# EAGLE design H3_MIDIController_Rev_2_PZBoard (EAGLE 7.6.0)
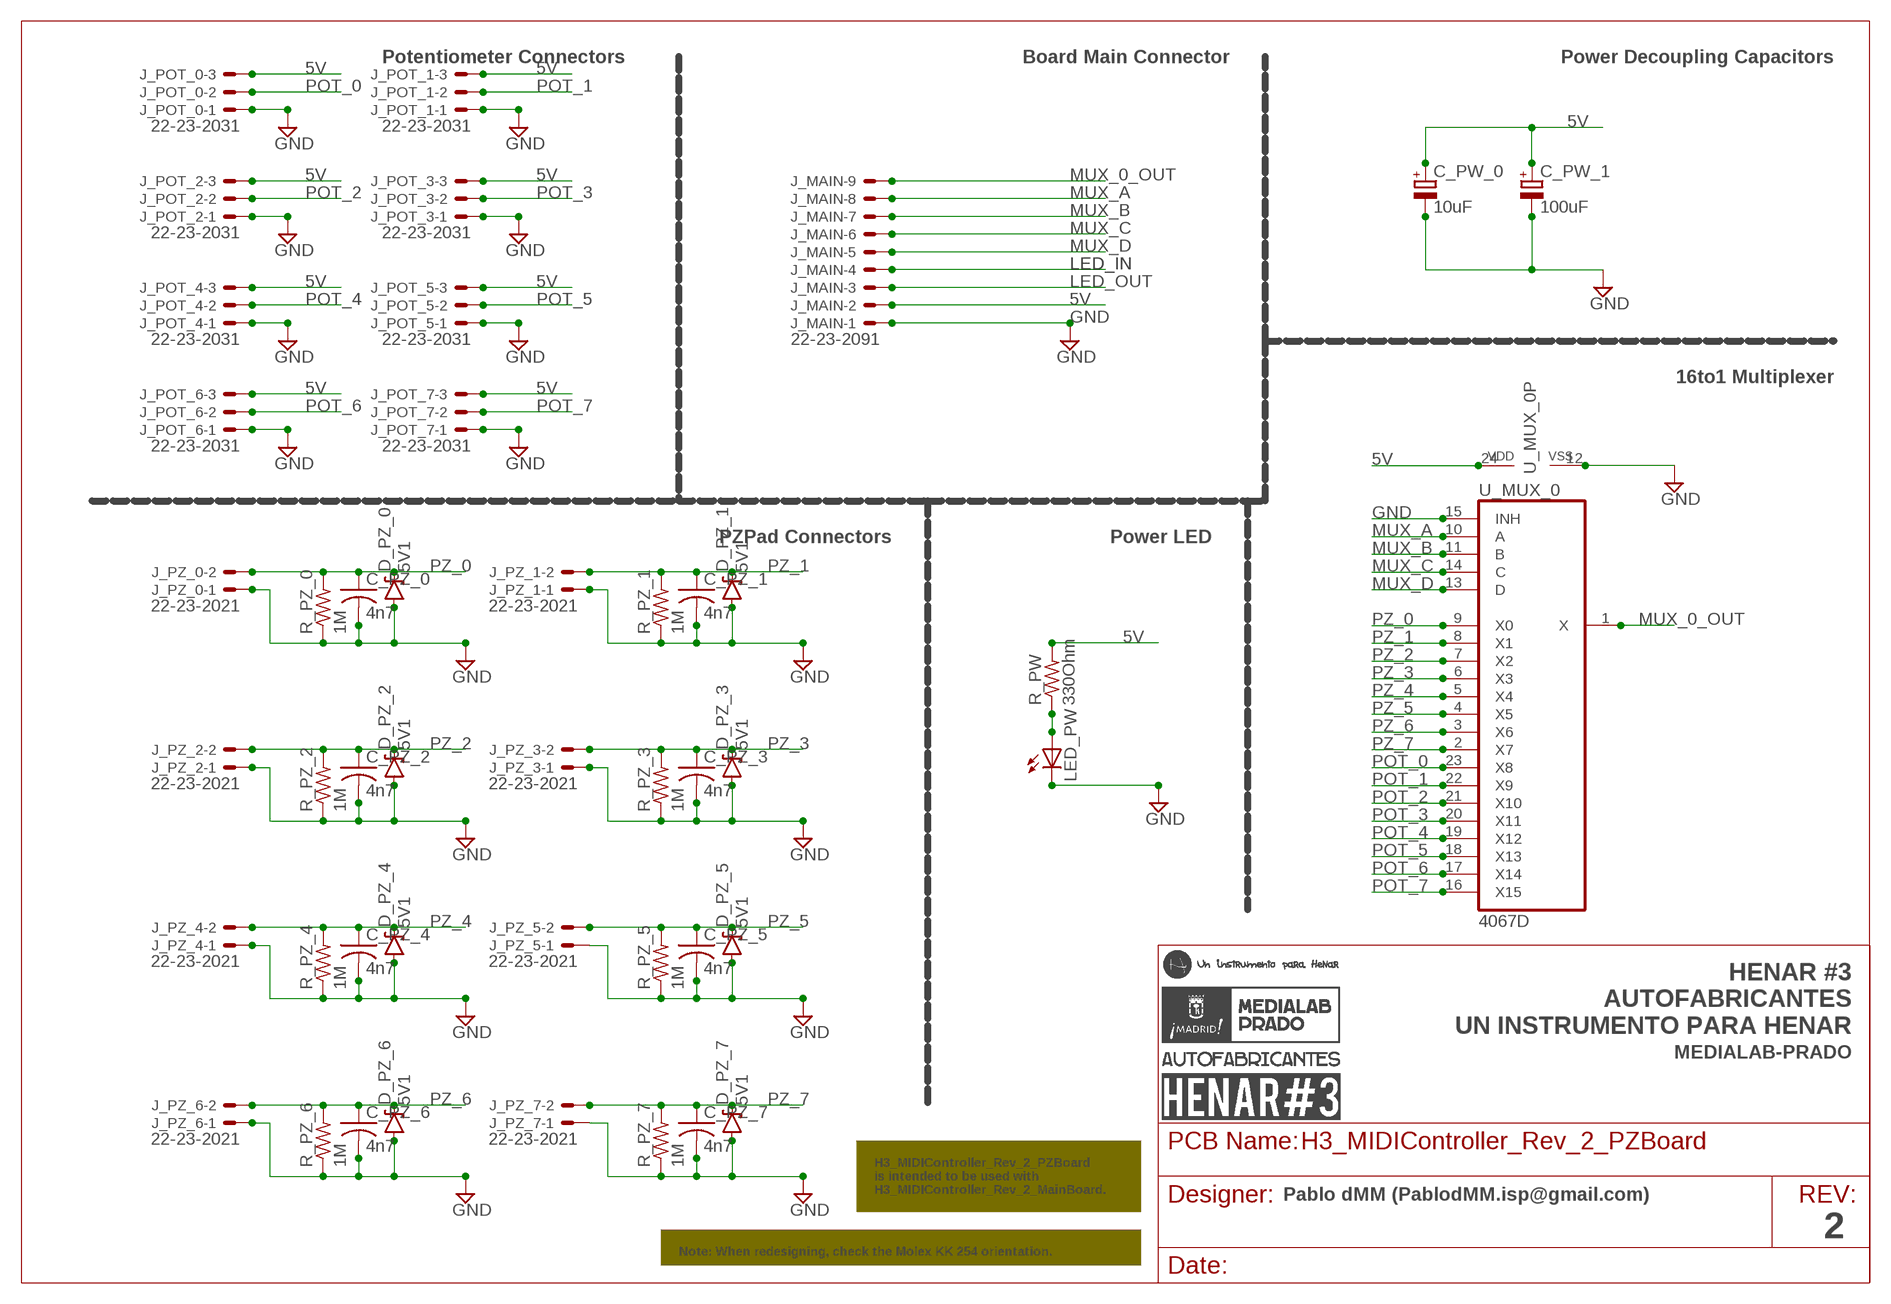
[diagram p0: schematic, sheet 1]

## Parts
C_PW_0  10uF  CPOL-EUTT2D6L  [TT2D6L]
C_PW_1  100uF  CPOL-EUTT2D6L  [TT2D6L]
C_PZ_0  4n7  C-USC1206  [C1206]
C_PZ_1  4n7  C-USC1206  [C1206]
C_PZ_2  4n7  C-USC1206  [C1206]
C_PZ_3  4n7  C-USC1206  [C1206]
C_PZ_4  4n7  C-USC1206  [C1206]
C_PZ_5  4n7  C-USC1206  [C1206]
C_PZ_6  4n7  C-USC1206  [C1206]
C_PZ_7  4n7  C-USC1206  [C1206]
D_PZ_0  5V1  DIODE-ZENER  [DIODE-BZT52]
D_PZ_1  5V1  DIODE-ZENER  [DIODE-BZT52]
D_PZ_2  5V1  DIODE-ZENER  [DIODE-BZT52]
D_PZ_3  5V1  DIODE-ZENER  [DIODE-BZT52]
D_PZ_4  5V1  DIODE-ZENER  [DIODE-BZT52]
D_PZ_5  5V1  DIODE-ZENER  [DIODE-BZT52]
D_PZ_6  5V1  DIODE-ZENER  [DIODE-BZT52]
D_PZ_7  5V1  DIODE-ZENER  [DIODE-BZT52]
J_MAIN  22-23-2091  [22-23-2091]
J_POT_0  22-23-2031  [22-23-2031]
J_POT_1  22-23-2031  [22-23-2031]
J_POT_2  22-23-2031  [22-23-2031]
J_POT_3  22-23-2031  [22-23-2031]
J_POT_4  22-23-2031  [22-23-2031]
J_POT_5  22-23-2031  [22-23-2031]
J_POT_6  22-23-2031  [22-23-2031]
J_POT_7  22-23-2031  [22-23-2031]
J_PZ_0  22-23-2021  [22-23-2021]
J_PZ_1  22-23-2021  [22-23-2021]
J_PZ_2  22-23-2021  [22-23-2021]
J_PZ_3  22-23-2021  [22-23-2021]
J_PZ_4  22-23-2021  [22-23-2021]
J_PZ_5  22-23-2021  [22-23-2021]
J_PZ_6  22-23-2021  [22-23-2021]
J_PZ_7  22-23-2021  [22-23-2021]
LED_PW  LEDSMT1206  [1206]
R_PW  330Ohm  R-US_M1206  [M1206]
R_PZ_0  1M  R-US_M1206  [M1206]
R_PZ_1  1M  R-US_M1206  [M1206]
R_PZ_2  1M  R-US_M1206  [M1206]
R_PZ_3  1M  R-US_M1206  [M1206]
R_PZ_4  1M  R-US_M1206  [M1206]
R_PZ_5  1M  R-US_M1206  [M1206]
R_PZ_6  1M  R-US_M1206  [M1206]
R_PZ_7  1M  R-US_M1206  [M1206]
U_MUX_0  4067D  [SO24W]

## Nets
5V: C_PW_0.+ C_PW_1.+ J_MAIN.2 J_POT_0.3 J_POT_1.3 J_POT_2.3 J_POT_3.3 J_POT_4.3 J_POT_5.3 J_POT_6.3 J_POT_7.3 R_PW.2 U_MUX_0.24(VDD)
GND: C_PW_0.- C_PW_1.- C_PZ_0.2 C_PZ_1.2 C_PZ_2.2 C_PZ_3.2 C_PZ_4.2 C_PZ_5.2 C_PZ_6.2 C_PZ_7.2 D_PZ_0.A D_PZ_1.A D_PZ_2.A D_PZ_3.A D_PZ_4.A D_PZ_5.A D_PZ_6.A D_PZ_7.A J_MAIN.1 J_POT_0.1 J_POT_1.1 J_POT_2.1 J_POT_3.1 J_POT_4.1 J_POT_5.1 J_POT_6.1 J_POT_7.1 J_PZ_0.1 J_PZ_1.1 J_PZ_2.1 J_PZ_3.1 J_PZ_4.1 J_PZ_5.1 J_PZ_6.1 J_PZ_7.1 LED_PW.C R_PZ_0.1 R_PZ_1.1 R_PZ_2.1 R_PZ_3.1 R_PZ_4.1 R_PZ_5.1 R_PZ_6.1 R_PZ_7.1 U_MUX_0.12(VSS) U_MUX_0.15(INH)
LED_IN: J_MAIN.4
LED_OUT: J_MAIN.3
MUX_0_OUT: J_MAIN.9 U_MUX_0.1(X)
MUX_A: J_MAIN.8 U_MUX_0.10(A)
MUX_B: J_MAIN.7 U_MUX_0.11(B)
MUX_C: J_MAIN.6 U_MUX_0.14(C)
MUX_D: J_MAIN.5 U_MUX_0.13(D)
N$2: LED_PW.A R_PW.1
POT_0: J_POT_0.2 U_MUX_0.23(X8)
POT_1: J_POT_1.2 U_MUX_0.22(X9)
POT_2: J_POT_2.2 U_MUX_0.21(X10)
POT_3: J_POT_3.2 U_MUX_0.20(X11)
POT_4: J_POT_4.2 U_MUX_0.19(X12)
POT_5: J_POT_5.2 U_MUX_0.18(X13)
POT_6: J_POT_6.2 U_MUX_0.17(X14)
POT_7: J_POT_7.2 U_MUX_0.16(X15)
PZ_0: C_PZ_0.1 D_PZ_0.C J_PZ_0.2 R_PZ_0.2 U_MUX_0.9(X0)
PZ_1: C_PZ_1.1 D_PZ_1.C J_PZ_1.2 R_PZ_1.2 U_MUX_0.8(X1)
PZ_2: C_PZ_2.1 D_PZ_2.C J_PZ_2.2 R_PZ_2.2 U_MUX_0.7(X2)
PZ_3: C_PZ_3.1 D_PZ_3.C J_PZ_3.2 R_PZ_3.2 U_MUX_0.6(X3)
PZ_4: C_PZ_4.1 D_PZ_4.C J_PZ_4.2 R_PZ_4.2 U_MUX_0.5(X4)
PZ_5: C_PZ_5.1 D_PZ_5.C J_PZ_5.2 R_PZ_5.2 U_MUX_0.4(X5)
PZ_6: C_PZ_6.1 D_PZ_6.C J_PZ_6.2 R_PZ_6.2 U_MUX_0.3(X6)
PZ_7: C_PZ_7.1 D_PZ_7.C J_PZ_7.2 R_PZ_7.2 U_MUX_0.2(X7)

## Notes on the sheet
- Potentiometer Connectors | Board Main Connector | Power Decoupling Capacitors
- 16to1 Multiplexer
- PZPad Connectors | Power LED
- HENAR #3
  AUTOFABRICANTES
  UN INSTRUMENTO PARA HENAR
- MEDIALAB-PRADO
- H3_MIDIController_Rev_2_PZBoard
  is intended to be used with
  H3_MIDIController_Rev_2_MainBoard.
- Pablo dMM (PablodMM.isp@gmail.com)
- 2
- Note: When redesigning, check the Molex KK 254 orientation.

## Library data of the parts
C_PW_0 C_PW_1 = rcl:CPOL-EU: POLARIZED CAPACITOR, European symbol
C_PZ_0 C_PZ_1-C_PZ_7 = adafruit:C-US: CAPACITOR, American symbol
D_PZ_0 D_PZ_1-D_PZ_7 = SparkFun-DiscreteSemi:DIODE-ZENER: Zener Diode Production Part - 8199 3.4V Zener Voltage; PROD-ID: DIO-08199; VALUE: BZT52
J_MAIN = con-molex:22-23-2091: .100" (2.54mm) Center Header - 9 Pin; MF: MOLEX; MPN: 22-23-2091; OC_FARNELL: 1756827; OC_NEWARK: 56H0450
J_POT_0 J_POT_1-J_POT_7 = con-molex:22-23-2031: .100" (2.54mm) Center Header - 3 Pin; MF: MOLEX; MPN: 22-23-2031; OC_FARNELL: 1462950; OC_NEWARK: 30C0862
J_PZ_0 J_PZ_1-J_PZ_7 = con-molex:22-23-2021: .100" (2.54mm) Center Header - 2 Pin; MF: MOLEX; MPN: 22-23-2021; OC_FARNELL: 1462926; OC_NEWARK: 25C3832
LED_PW = adafruit:LED: LED OSRAM: - CHIPLED LG R971, LG N971, LY N971, LG Q971, LY Q971, LO R971, LY R971 LH N974, LH R974 LS Q976, LO Q976, LY Q976 LO Q996 - Hyper CHIPLED LW Q18S LB Q993, LB Q99A, LB R99A - SideLED LS A670, LO A670, LY A670, LG A670, LP A670 LB A673, LV A673, LT A673, LW A673 LH A674 LY A675 LS A676, LA A676, LO A676, LY A676, LW A676 LS A679, LY A679, LG A679 - Hyper Micro SIDELED® LS Y876, LA Y876, LO Y876, LY Y876 LT Y87S - SmartLED LW L88C, LW L88S LB L89C, LB L89S, LG L890 LS L89K, LO L89K, LY L89K LS L896, LA L896, LO L896, LY L896 - TOPLED LS T670, LO T670, LY T670, LG T670, LP T670 LSG T670, LSP T670, LSY T670, LOP T670, LYG T670 LG T671, LOG T671, LSG T671 LB T673, LV T673, LT T673, LW T673 LH T674 LS T676, LA T676, LO T676, LY T676, LB T676, LH T676, LSB T676, LW T676 LB T67C, LV T67C, LT T67C, LS T67K, LO T67K, LY T67K, LW E67C LS E67B, LA E67B, LO E67B, LY E67B, LB E67C, LV E67C, LT E67C LW T67C LS T679, LY T679, LG T679 LS T770, LO T770, LY T770, LG T770, LP T770 LB T773, LV T773, LT T773, LW T773 LH T774 LS E675, LA E675, LY E675, LS T675 LS T776, LA T776, LO T776, LY T776, LB T776 LHGB T686 LT T68C, LB T68C - Hyper Mini TOPLED® LB M676 - Mini TOPLED Santana® LG M470 LS M47K, LO M47K, LY M47K Source: http://www.osram.convergy.de/
R_PW R_PZ_0 R_PZ_1-R_PZ_7 = adafruit:R-US_: RESISTOR, American symbol
U_MUX_0 = 40xx:4067: 16-channel ANALOG MULTIPLEXER

## Board
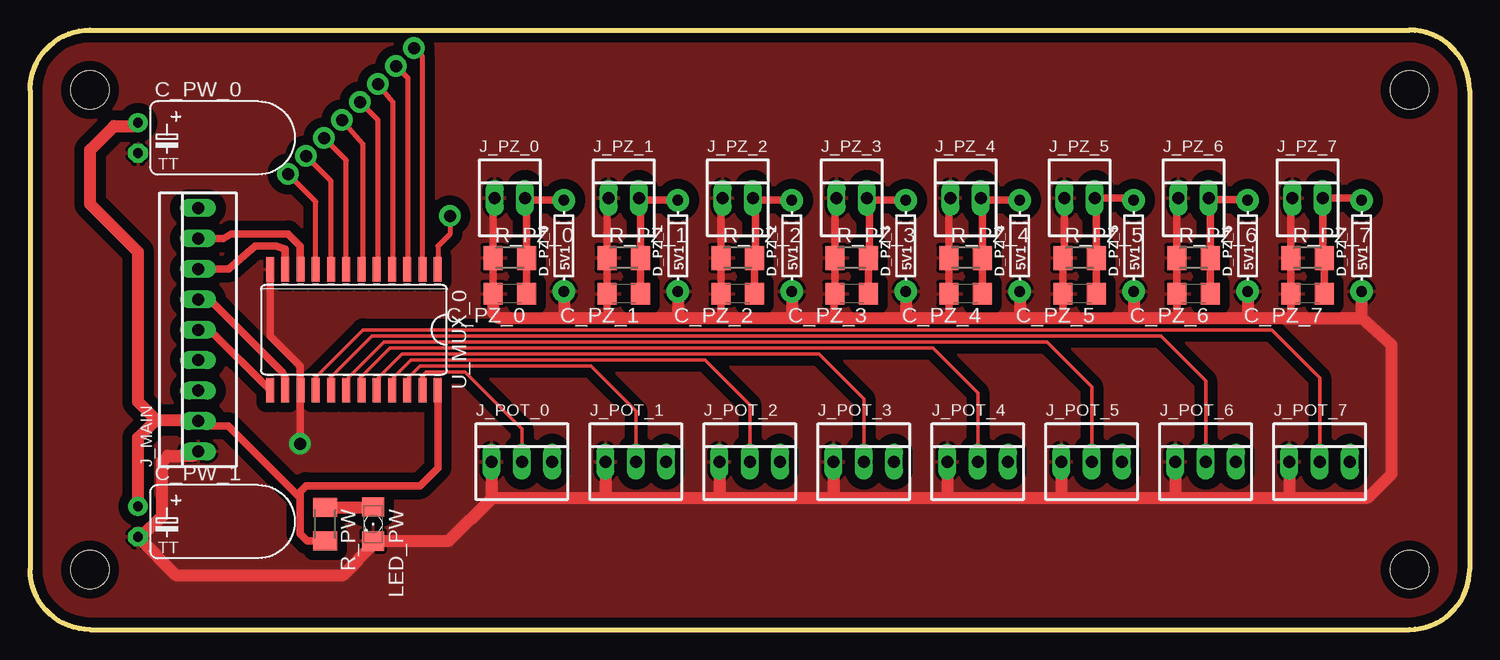
[diagram p1: board, top side]
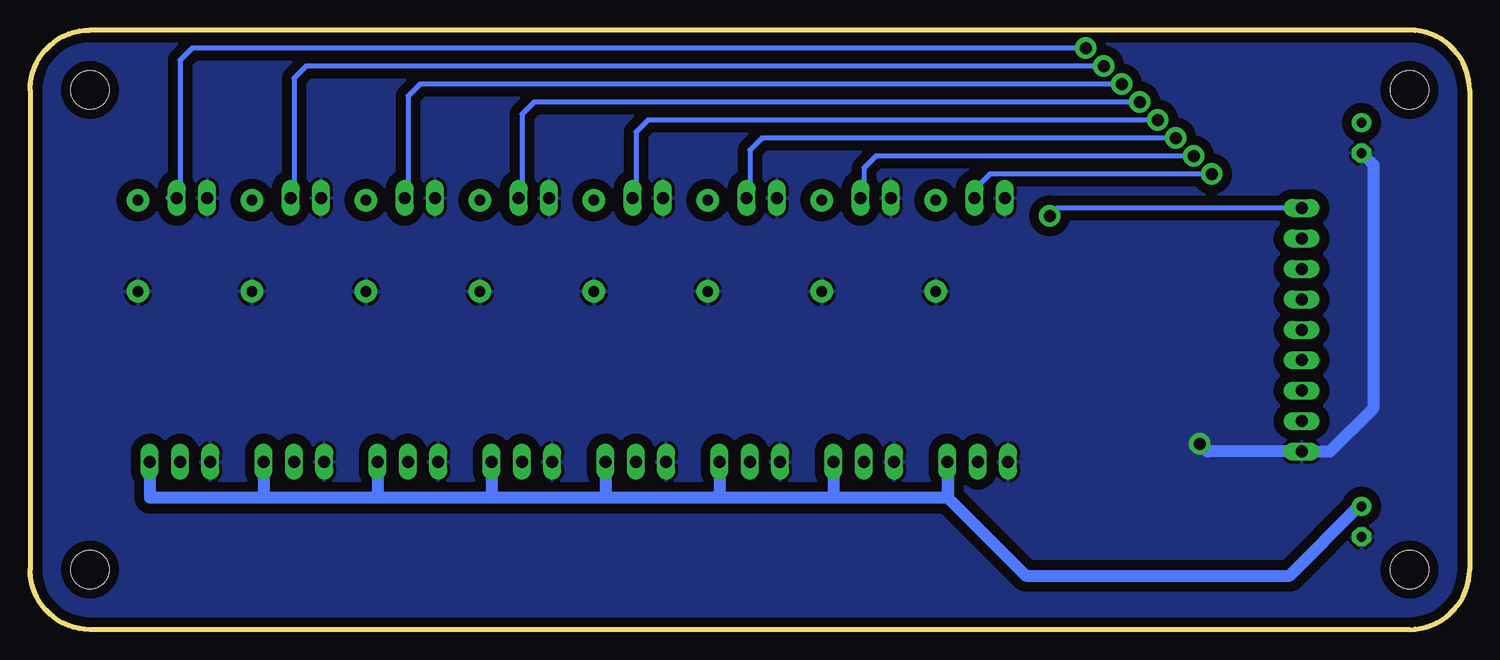
[diagram p2: board, bottom side, seen from below]

Size 120 x 50 mm. Coordinates in mm from the lower left corner, seen from the top.
Outline: 5,0 115,0 arc90 120,5 120,45 arc90 115,50 5,50 arc90 0,45 0,5 arc90 5,0
Copper layers (1*16): Top 0.035mm / dielectric 1.5mm / Bottom 0.035mm
Design rules "default *": minimum track width 12mil, minimum drill 25mil, track to track 15mil, track to pad 15mil, pad to pad 15mil, via to via 15mil, smd to smd 8mil, copper to edge 20mil, drill to drill 8mil, minimum pad ring 10mil, minimum via ring 15mil, stop-mask expansion 4mil, vias tented up to drill 0mil, thermal gap 10mil
Holes 3.2 mm at 115,45 115,5 5,5 5,45
vRestrict: area 20.5,19.2 to 36.5,30.2; area 0,14 to 17,36

### Footprints (pad centres in the part's own frame; a part is rotated, then mirrored left to right if it is on the bottom)
TT2D6L = drill 0.813 pad 1.6: + -1.27,0 | drill 0.813 pad 1.6 octagon: - 1.27,0
C1206 = smd 1.6 x 1.8: 1 -1.4,0; 2 1.4,0
DIODE-BZT52 = drill 0.9 pad 1.88: A -3.81,0; C 3.81,0
22-23-2091 = drill 1 long: 1 -10.16,0; 2 -7.62,0; 3 -5.08,0; 4 -2.54,0; 5 0,0; 6 2.54,0; 7 5.08,0; 8 7.62,0; 9 10.16,0
22-23-2031 = drill 1 long: 1 -2.54,0; 2 0,0; 3 2.54,0
22-23-2021 = drill 1 long: 1 -1.27,0; 2 1.27,0
1206 = smd 1.6 x 1.803: A -1.422,0; C 1.422,0
M1206 = smd 1.6 x 2: 1 -1.4,0; 2 1.4,0
SO24W = smd 0.66 x 2.032: 1 -6.985,-5.029; 2 -5.715,-5.029; 3 -4.445,-5.029; 4 -3.175,-5.029; 5 -1.905,-5.029; 6 -0.635,-5.029; 7 0.635,-5.029; 8 1.905,-5.029; 9 3.175,-5.029; 10 4.445,-5.029; 11 5.715,-5.029; 12 6.985,-5.029; 13 6.985,5.029; 14 5.715,5.029; 15 4.445,5.029; 16 3.175,5.029; 17 1.905,5.029; 18 0.635,5.029; 19 -0.635,5.029; 20 -1.905,5.029; 21 -3.175,5.029; 22 -4.445,5.029; 23 -5.715,5.029; 24 -6.985,5.029

### Placement (x,y rotation side)
C_PW_0  9,41 270 top
C_PW_1  9,9 270 top
C_PZ_0  40,28 180 top
C_PZ_1  49.5,28 180 top
C_PZ_2  59,28 180 top
C_PZ_3  68.5,28 180 top
C_PZ_4  78,28 180 top
C_PZ_5  87.5,28 180 top
C_PZ_6  97,28 180 top
C_PZ_7  106.5,28 180 top
D_PZ_0  44.5,32 90 top
D_PZ_1  54,32 90 top
D_PZ_2  63.5,32 90 top
D_PZ_3  73,32 90 top
D_PZ_4  82.5,32 90 top
D_PZ_5  92,32 90 top
D_PZ_6  101.5,32 90 top
D_PZ_7  111,32 90 top
J_MAIN  14,25 90 top
J_POT_0  41,14 0 top
J_POT_1  50.5,14 0 top
J_POT_2  60,14 0 top
J_POT_3  69.5,14 0 top
J_POT_4  79,14 0 top
J_POT_5  88.5,14 0 top
J_POT_6  98,14 0 top
J_POT_7  107.5,14 0 top
J_PZ_0  40,36 0 top
J_PZ_1  49.5,36 0 top
J_PZ_2  59,36 0 top
J_PZ_3  68.5,36 0 top
J_PZ_4  78,36 0 top
J_PZ_5  87.5,36 0 top
J_PZ_6  97,36 0 top
J_PZ_7  106.5,36 0 top
LED_PW  28.6,8.8 270 top
R_PW  24.6,8.8 270 top
R_PZ_0  40,31 0 top
R_PZ_1  49.5,31 0 top
R_PZ_2  59,31 0 top
R_PZ_3  68.5,31 0 top
R_PZ_4  78,31 0 top
R_PZ_5  87.5,31 0 top
R_PZ_6  97,31 0 top
R_PZ_7  106.5,31 0 top
U_MUX_0  27,25 180 top

### Tracks (layer width: path | path; a pad name or v marks a point on that pad's centre or on a via)
5V
  Top 0.61: R_PW.2 23.1,7.4 22.5,8 22.5,11 | 22.5,11 16.5,17 14.38,17 J_MAIN.2 | 22.5,11 22.5,11.5 23,12 32.5,12 34,13.5 34,19.96 U_MUX_0.24
  Top 1.016: C_PW_1.+ 9,16 10.5,17.5 | 10.5,17.5 13.88,17.5 J_MAIN.2 | 10.5,17.5 9,19 9,31.5 5,35.5 5,40 7,42 8.73,42 C_PW_0.+
  Bottom 1.016: 43.5,11 43.54,11.04 J_POT_0.3 43.5,13.96 43.5,11 | 43.5,11 53,11 | 53,11 62.5,11 | 62.5,11 72,11 | 72,11 81.5,11 | 81.5,11 91,11 | 91,11 100.5,11 | 100.5,11 110,11 110,13.96 J_POT_7.3 | J_POT_6.3 100.54,11.04 100.5,11 | J_POT_5.3 91.04,11.04 91,11 | J_POT_4.3 81.54,11.04 81.5,11 | J_POT_3.3 72.04,11.04 72,11 | J_POT_2.3 62.54,11.04 62.5,11 | J_POT_1.3 53.04,11.04 53,11 | 43.5,11 37,4.5 15,4.5 9.23,10.27 C_PW_1.+
GND  (via drill 1)
  Top 0.61: J_PZ_1.1 48.1,35.87 R_PZ_1.1 C_PZ_1.2 48.1,26.1 | J_PZ_0.1 38.6,35.87 R_PZ_0.1 C_PZ_0.2 | J_PZ_2.1 57.6,35.87 R_PZ_2.1 C_PZ_2.2 57.6,26.1 57.5,26 | J_PZ_3.1 67.1,35.87 R_PZ_3.1 C_PZ_3.2 | C_PZ_3.2 67,28 | 67,26 67,27.9 C_PZ_3.2 | 76.5,26 76.6,26.1 C_PZ_4.2 R_PZ_4.1 76.6,35.87 J_PZ_4.1 | J_PZ_5.1 86.23,31.13 R_PZ_5.1 C_PZ_5.2 86.1,26.1 86,26 | 95.5,26 95.6,25.85 C_PZ_6.2 R_PZ_6.1 95.6,35.87 J_PZ_6.1 | J_PZ_7.1 105.1,35.87 R_PZ_7.1 C_PZ_7.2 105.1,26.4 105.5,26 | U_MUX_0.12 20.02,24.48 22.5,22 22.5,20.03 U_MUX_0.15 22.5,19.92 v22.5,15.5
  Top 1.016: C_PZ_0.2 38.6,26.4 39,26 44.5,26 | 44.5,26 48,26 | 48,26 54,26 | 54,26 57.5,26 63.5,26 | 63.5,26 67,26 73,26 | 73,26 76.5,26 82.5,26 | 82.5,26 86,26 92,26 | 92,26 95.5,26 101.5,26 | 101.5,26 105.5,26 111,26 | 111,26 113.5,23.75 113.5,13 111.5,11 105,11 | 111,26 D_PZ_7.A | D_PZ_6.A 101.5,26 | D_PZ_5.A 92,26 | D_PZ_4.A 82.5,26 | D_PZ_3.A 73,26 | D_PZ_2.A 63.5,26 | D_PZ_1.A 54,26 | D_PZ_0.A 44.5,26 | 48.1,26.1 48,26 | 38.5,11 34.88,7.38 LED_PW.C 28.6,7.1 26,4.5 12.23,4.5 C_PW_1.- 9.23,7.73 11,9.5 11,14 11.5,14.5 13.66,14.5 J_MAIN.1 | 38.5,11 38.5,13.96 J_POT_0.1 38.46,11.04 38.5,11 | 38.5,11 48,11 | 48,11 57.5,11 | 57.5,11 67,11 | 67,11 76.5,11 | 76.5,11 86,11 | 86,11 95.5,11 | 95.5,11 105,11 | 105,11 105,13.96 J_POT_7.1 | J_POT_5.1 85.96,11.04 86,11 | J_POT_4.1 76.46,11.04 76.5,11 | J_POT_3.1 66.96,11.04 67,11 | J_POT_2.1 57.46,11.04 57.5,11 | J_POT_1.1 47.96,11.04 48,11 | J_POT_6.1 95.46,11.04 95.5,11
  Bottom 1.016: C_PW_0.- 8,38.73 8,18.5 11.66,14.84 J_MAIN.1 21.84,14.84 v22.5,15.5
  pour Bottom (isolate 0.813): 0,45 arc-90 5,50 115,50 arc-90 120,45 120,5 arc-90 115,0 5,0 arc-90 0,5
  pour Top (isolate 0.813): 0,45 arc-90 5,50 115,50 arc-90 120,45 120,5 arc-90 115,0 5,0 arc-90 0,5
MUX_0_OUT  (via drill 1)
  Top 0.406: v35,34.5 35,33 34,32 34,30.04 U_MUX_0.1
  Bottom 0.406: J_MAIN.9 34.34,35.16 v35,34.5
MUX_A
  Top 0.61: J_MAIN.8 16.12,32.62 16.75,33 21.5,33 22.5,32 22.5,30.08 U_MUX_0.10
MUX_B
  Top 0.61: J_MAIN.7 16.58,30.08 18.75,32 20.5,32 21.25,31.75 21.25,30.56 U_MUX_0.11
MUX_C
  Top 0.61: J_MAIN.6 14.96,27.54 21,21.5 21.25,21.01 U_MUX_0.14
MUX_D
  Top 0.61: J_MAIN.5 14.99,25 U_MUX_0.13
N$1
  pour Bottom (isolate 0.813): 0,45 arc-90 5,50 115,50 arc-90 120,45 120,5 arc-90 115,0 5,0 arc-90 0,5
N$2
  Top 1.016: R_PW.1 28.58,10.2 LED_PW.A
N$3
  pour Top (isolate 0.813): 0,45 arc-90 5,50 115,50 arc-90 120,45 120,5 arc-90 115,0 5,0 arc-90 0,5
POT_0
  Top 0.305: U_MUX_0.23 32.72,20.96 | 32.75,21 32.75,21.25 33,21.5 36.25,21.5 41,16.75 J_POT_0.2
  Top 0.406: 32.72,20.96 32.75,21
POT_1
  Top 0.305: 31.5,20.03 31.5,21 32.5,22 46.75,22 50.5,18.25 J_POT_1.2
  Top 0.406: U_MUX_0.22 31.5,20.03
POT_2
  Top 0.305: U_MUX_0.21 30.25,21 31.75,22.5 56.25,22.5 60,18.75 J_POT_2.2
POT_3
  Top 0.305: 29,20.07 29,21 31,23 65.75,23 69.5,19.25 J_POT_3.2
  Top 0.406: U_MUX_0.20 29,20.07
POT_4
  Top 0.305: U_MUX_0.19 27.5,20.11 27.5,21 30,23.5 75.25,23.5 79,19.75 J_POT_4.2
POT_5
  Top 0.305: U_MUX_0.18 26.5,20.11 26.5,21 29.5,24 84.75,24 88.5,20.25 J_POT_5.2
POT_6
  Top 0.305: U_MUX_0.17 25,20.07 25,21 28.5,24.5 94.25,24.5 98,20.75 J_POT_6.2
POT_7
  Top 0.305: U_MUX_0.16 23.75,20.05 23.75,21 27.75,25 103.5,25 107.5,21 J_POT_7.2
PZ_0  (via drill 1)
  Top 0.406: U_MUX_0.9 23.82,35.67 v21.5,38
  Top 0.61: D_PZ_0.C 41.46,35.81 J_PZ_0.2 41.4,35.87 R_PZ_0.2 C_PZ_0.1
  Bottom 0.406: v21.5,38 40,38 41,37 41,36.27 J_PZ_0.2
PZ_1  (via drill 1)
  Top 0.406: U_MUX_0.8 25.09,37.41 v23,39.5
  Top 0.61: C_PZ_1.1 R_PZ_1.2 50.9,35.87 J_PZ_1.2 50.96,35.81 D_PZ_1.C
  Bottom 0.406: v23,39.5 49.5,39.5 50.5,38.5 50.5,36.27 J_PZ_1.2
PZ_2  (via drill 1)
  Top 0.406: U_MUX_0.7 26.36,39.13 v24.5,41
  Top 0.61: D_PZ_2.C 60.46,35.81 | 60.46,35.81 J_PZ_2.2 | 60.46,35.81 60.46,31.06 R_PZ_2.2 C_PZ_2.1
  Bottom 0.406: v24.5,41 59,41 60,40 60,36.27 J_PZ_2.2
PZ_3  (via drill 1)
  Top 0.406: U_MUX_0.6 27.75,30.89 27.75,40.5 v26,42.5
  Top 0.61: D_PZ_3.C 69.96,35.81 | 69.96,35.81 J_PZ_3.2 | 69.96,35.81 69.96,31.06 R_PZ_3.2 C_PZ_3.1
  Bottom 0.406: v26,42.5 68.5,42.5 69.5,41.5 69.5,36.27 J_PZ_3.2
PZ_4  (via drill 1)
  Top 0.406: U_MUX_0.5 29,30.12 29,42.5 v27.5,44
  Top 0.61: C_PZ_4.1 R_PZ_4.2 79.4,35.5 | 79.4,35.5 79.4,35.87 J_PZ_4.2 | D_PZ_4.C 79.71,35.81 79.4,35.5
  Bottom 0.406: v27.5,44 78,44 79,43 79,36.27 J_PZ_4.2
PZ_5  (via drill 1)
  Top 0.406: U_MUX_0.4 30.25,30.85 30.25,44 v29,45.5
  Top 0.61: D_PZ_5.C 91.81,36 J_PZ_5.2 88.9,35.87 R_PZ_5.2 C_PZ_5.1
  Bottom 0.406: v29,45.5 87.5,45.5 88.5,44.5 88.5,36.27 J_PZ_5.2
PZ_6  (via drill 1)
  Top 0.406: U_MUX_0.3 31.5,30.08 31.5,46 v30.5,47
  Top 0.61: C_PZ_6.1 R_PZ_6.2 98.4,35.87 | 98.4,35.87 J_PZ_6.2 | 98.4,35.87 101.44,35.87 D_PZ_6.C
  Bottom 0.406: v30.5,47 97,47 98,46 98,36.27 J_PZ_6.2
PZ_7  (via drill 1)
  Top 0.406: U_MUX_0.2 32.72,47.78 v32,48.5
  Top 0.61: D_PZ_7.C 110.81,36 J_PZ_7.2 107.77,31.13 R_PZ_7.2 C_PZ_7.1
  Bottom 0.406: v32,48.5 106.5,48.5 107.5,47.5 107.5,37 | 107.5,36.5 107.5,36.27 J_PZ_7.2 | 107.5,36 J_PZ_7.2 | 108,36 108,36.5 | 108,36.5 108,37 | J_PZ_7.2 108,36 | 108,36 107.5,36.5 | 107.5,36.5 107.5,37 | 107.5,37 108,36.5 | 108,36.5 108.5,36 108,36